# Altium project Main_board.PrjPcb
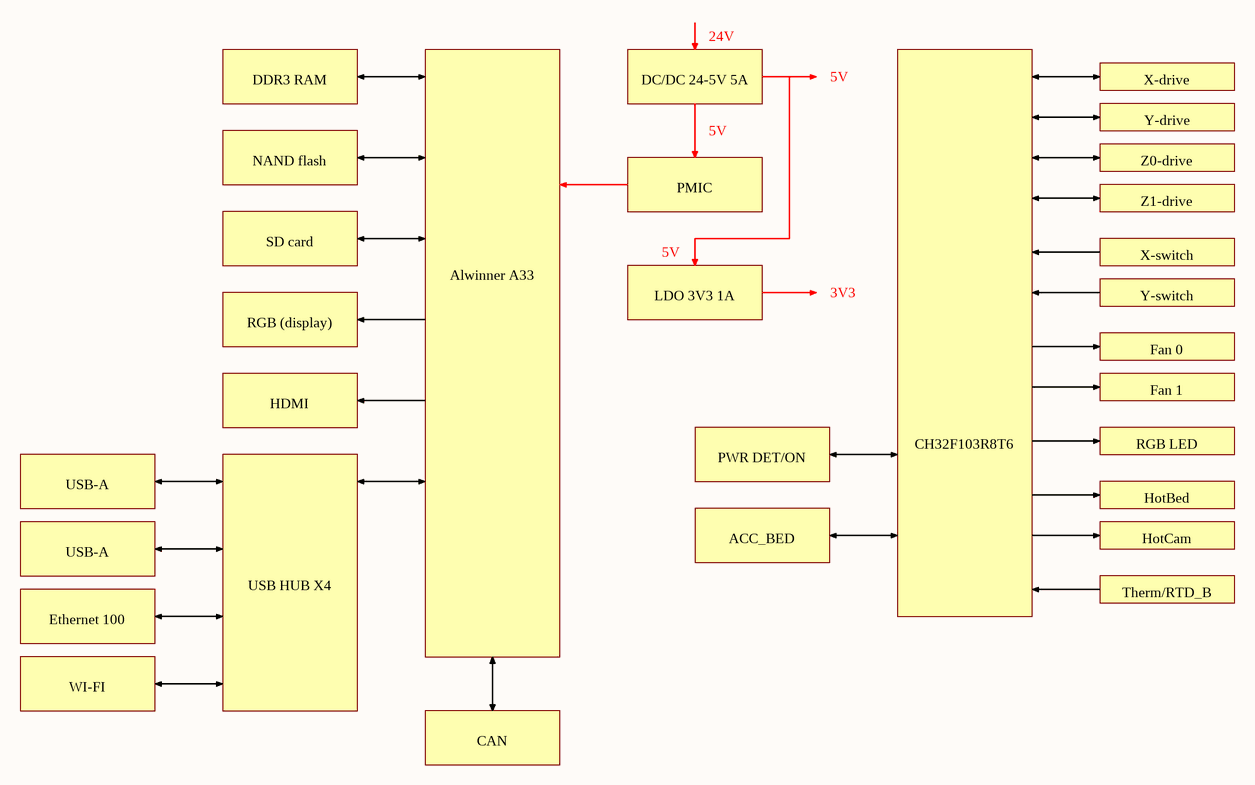
[diagram p0: Function Block Diagram.SchDoc]
5 sheets, 12 parts. Net scope: flat (ports and power ports of the same name join across sheets).
Board file: Main_board.PcbDoc
Sheets:
  Function Block Diagram.SchDoc
  NAND flash.SchDoc
  Wi-Fi AP6212.SchDoc
  PMIC AXP223.SchDoc
  CAN bus XL2515.SchDoc

## Sheet Function Block Diagram.SchDoc
size A4; SheetNumber: 1; SheetTotal: 2

### Notes on the sheet
- 24V
- DDR3 RAM
- DC/DC 24-5V 5A
- 5V
- X-drive
- Y-drive
- Z0-drive
- NAND flash
- PMIC
- Z1-drive
- SD card
- 3V3
- X-switch
- Y-switch
- RGB (display)
- LDO 3V3 1A
- Fan 0
- HDMI
- Fan 1
- USB-A
- PWR DET/ON
- RGB LED
- HotBed
- ACC_BED
- HotCam
- Ethernet 100
- CH32F103R8T6
- Therm/RTD_B
- WI-FI
- USB HUB X4
- Alwinner A33
- CAN

## Sheet NAND flash.SchDoc
size A4; SheetNumber: 5; SheetTotal: 12
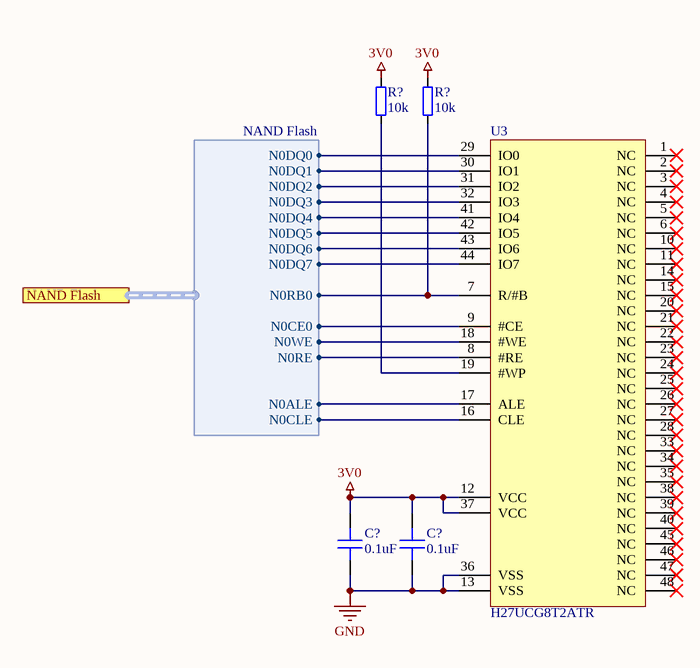
[diagram p1: NAND flash.SchDoc]

### Parts
(Parts that share a designator on the sheet are numbered #1, #2 ... from top to bottom, then left to right.)
C?#1  0.1uF  [CAPC1005X06N]
C?#2  0.1uF  [CAPC1005X06N]
R?#1  10k  [RESC1005X35N]
R?#2  10k  [RESC1005X35N]
U3  H27UCG8T2ATR  [TSSOP50P2000X120-48N]

### Ports
NAND Flash (harness NAND Flash)

### Harnesses
NAND Flash: N0DQ0, N0DQ1, N0DQ2, N0DQ3, N0DQ4, N0DQ5, N0DQ6, N0DQ7, N0RB0, N0CE0, N0WE, N0RE, N0ALE, N0CLE

### Nets
3V0: C?#1.1 C?#2.1 R?#1.1 R?#2.2 U3.12(VCC) U3.37(VCC)
GND: C?#1.2 C?#2.2 U3.13(VSS) U3.36(VSS)
NetR?#1_2: R?#1.2 U3.19(#WP)
NetR?#2_1: R?#2.1 U3.7(R/#B) ; port NAND Flash.N0RB0
NetU3_8: U3.8(#RE) ; port NAND Flash.N0RE
NetU3_9: U3.9(#CE) ; port NAND Flash.N0CE0
NetU3_16: U3.16(CLE) ; port NAND Flash.N0CLE
NetU3_17: U3.17(ALE) ; port NAND Flash.N0ALE
NetU3_18: U3.18(#WE) ; port NAND Flash.N0WE
NetU3_29: U3.29(IO0) ; port NAND Flash.N0DQ0
NetU3_30: U3.30(IO1) ; port NAND Flash.N0DQ1
NetU3_31: U3.31(IO2) ; port NAND Flash.N0DQ2
NetU3_32: U3.32(IO3) ; port NAND Flash.N0DQ3
NetU3_41: U3.41(IO4) ; port NAND Flash.N0DQ4
NetU3_42: U3.42(IO5) ; port NAND Flash.N0DQ5
NetU3_43: U3.43(IO6) ; port NAND Flash.N0DQ6
NetU3_44: U3.44(IO7) ; port NAND Flash.N0DQ7

Not connected (* = marked no-connect by the designer): U3 1(NC)* 2(NC)* 3(NC)* 4(NC)* 5(NC)* 6(NC)* 10(NC)* 11(NC)* 14(NC)* 15(NC)* 20(NC)* 21(NC)* 22(NC)* 23(NC)* 24(NC)* 25(NC)* 26(NC)* 27(NC)* 28(NC)* 33(NC)* 34(NC)* 35(NC)* 38(NC)* 39(NC)* 40(NC)* 45(NC)* 46(NC)* 47(NC)* 48(NC)*

### Library data of the parts
C?#1 C?#2 = 0402B104K500CT: Manufacturer: Walsin Tech Corp; Voltage: 50V; Tolerance: 10%; Dielectric: X7R; Min Temperature: -55; Max Temperature: 125; Part Number: 0402B104K500CT; ComponentLink1URL: https://datasheet.lcsc.com/lcsc/1810191621_Walsin-Tech-Corp-0402B104K500CT_C152814.pdf; ComponentLink1Description: Datasheet; Package: 0402; Part Status: Active; Capacitance: 0.1uF
R?#1 R?#2 = WR04X1002FTL: Resistor; Manufacturer: Walsin Tech Corp; Tolerance: 1%; Power: 1/16 W; Temperature Coefficient: 100ppm; Min Temperature: -55°C; Max Temperature: 155°C; Part Number: WR04X1002FTL; ComponentLink1URL: https://datasheet.lcsc.com/lcsc/2304140030_Walsin-Tech-Corp-WR04X1002FTL_C163810.pdf; ComponentLink1Description: Datasheet; Package: 0402; Part Status: Active; Resistance: 10k
U3 = H27UCG8T2ATR: NAND Flash Memory; MANUFACTURER: SK Hynix; Part Number: H27UCG8T2ATR; COMPONENTLINK1URL: https://z3d9b7u8.stackpathcdn.com/pdf-down/H/2/7/H27UCG8T2ATR-BC-Hynix.pdf; COMPONENTLINK1DESCRIPTION: Datasheet; PACKAGE: TSSOP-48; Part Status: Active

## Sheet Wi-Fi AP6212.SchDoc
size A4; SheetNumber: 6; SheetTotal: 12
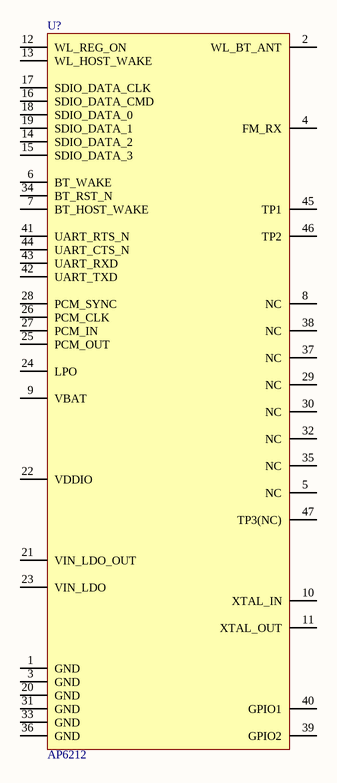
[diagram p2: Wi-Fi AP6212.SchDoc]

### Parts
(Parts that share a designator on the sheet are numbered #1, #2 ... from top to bottom, then left to right.)
U?#1  AP6212  [QFN-44_L12.0-W12.0-P0.90-TL_AP6212]

### Nets

Not connected (* = marked no-connect by the designer): U?#1 1(GND) 2(WL_BT_ANT) 3(GND) 4(FM_RX) 5(NC) 6(BT_WAKE) 7(BT_HOST_WAKE) 8(NC) 9(VBAT) 10(XTAL_IN) 11(XTAL_OUT) 12(WL_REG_ON) 13(WL_HOST_WAKE) 14(SDIO_DATA_2) 15(SDIO_DATA_3) 16(SDIO_DATA_CMD) 17(SDIO_DATA_CLK) 18(SDIO_DATA_0) 19(SDIO_DATA_1) 20(GND) 21(VIN_LDO_OUT) 22(VDDIO) 23(VIN_LDO) 24(LPO) 25(PCM_OUT) 26(PCM_CLK) 27(PCM_IN) 28(PCM_SYNC) 29(NC) 30(NC) 31(GND) 32(NC) 33(GND) 34(BT_RST_N) 35(NC) 36(GND) 37(NC) 38(NC) 39(GPIO2) 40(GPIO1) 41(UART_RTS_N) 42(UART_TXD) 43(UART_RXD) 44(UART_CTS_N) 45(TP1) 46(TP2) 47(TP3(NC))

### Library data of the parts
U?#1 = AP6212: WiFi+Bluetooth 4.0+FM RX Module; MANUFACTURER: AMPAK Tech; Part Number: AP6212; COMPONENTLINK1URL: https://datasheet.lcsc.com/lcsc/2111121030_AMPAK-Tech-AP6212_C2798300.pdf; COMPONENTLINK1DESCRIPTION: Datasheet; PACKAGE: ESP-12F; Part Status: Active

## Sheet PMIC AXP223.SchDoc
size A3; SheetNumber: 7; SheetTotal: 12
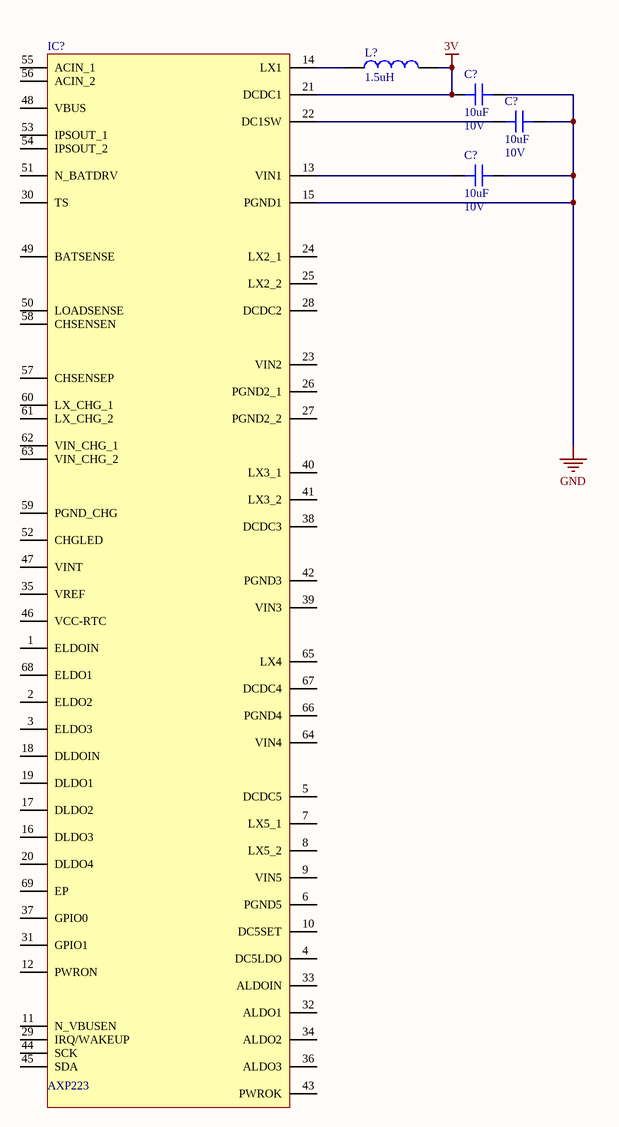
[diagram p3: PMIC AXP223.SchDoc]

### Parts
(Parts that share a designator on the sheet are numbered #1, #2 ... from top to bottom, then left to right.)
C?#3  Voltage: 10V  [CAPC2012X14N]  (hidden comment: 10uF)
C?#4  Voltage: 10V  [CAPC2012X14N]  (hidden comment: 10uF)
C?#5  Voltage: 10V  [CAPC2012X14N]  (hidden comment: 10uF)
IC?  AXP223  [QFN40P800X800X80-69N-D]
L?  1.5uH  [INDP400L400WX180_N]

### Nets
3V: C?#3.2 IC?.21(DCDC1) L?.2
GND: C?#3.1 C?#4.1 C?#5.1 IC?.15(PGND1)
NetC?#4_2: C?#4.2 IC?.22(DC1SW)
NetC?#5_2: C?#5.2 IC?.13(VIN1)
NetIC?_14: IC?.14(LX1) L?.1

Not connected (* = marked no-connect by the designer): IC? 1(ELDOIN) 2(ELDO2) 3(ELDO3) 4(DC5LDO) 5(DCDC5) 6(PGND5) 7(LX5_1) 8(LX5_2) 9(VIN5) 10(DC5SET) 11(N_VBUSEN) 12(PWRON) 16(DLDO3) 17(DLDO2) 18(DLDOIN) 19(DLDO1) 20(DLDO4) 23(VIN2) 24(LX2_1) 25(LX2_2) 26(PGND2_1) 27(PGND2_2) 28(DCDC2) 29(IRQ/WAKEUP) 30(TS) 31(GPIO1) 32(ALDO1) 33(ALDOIN) 34(ALDO2) 35(VREF) 36(ALDO3) 37(GPIO0) 38(DCDC3) 39(VIN3) 40(LX3_1) 41(LX3_2) 42(PGND3) 43(PWROK) 44(SCK) 45(SDA) 46(VCC-RTC) 47(VINT) 48(VBUS) 49(BATSENSE) 50(LOADSENSE) 51(N_BATDRV) 52(CHGLED) 53(IPSOUT_1) 54(IPSOUT_2) 55(ACIN_1) 56(ACIN_2) 57(CHSENSEP) 58(CHSENSEN) 59(PGND_CHG) 60(LX_CHG_1) 61(LX_CHG_2) 62(VIN_CHG_1) 63(VIN_CHG_2) 64(VIN4) 65(LX4) 66(PGND4) 67(DCDC4) 68(ELDO1) 69(EP)

### Library data of the parts
C?#3-C?#5 = 0805B106K100NT: Manufacturer: FH (Guangdong Fenghua Advanced Tech); Tolerance: 10%; Dielectric: X7R; Min Temperature: -55; Max Temperature: 125; Part Number: 0805B106K100NT; ComponentLink1URL: https://datasheet.lcsc.com/lcsc/2304140030_FH--Guangdong-Fenghua-Advanced-Tech-0805B106K100NT_C90544.pdf; ComponentLink1Description: Datasheet; Package: 0805; Part Status: Active; Capacitance: 10uF
IC? = AXP223: Integrated Circuit; MANUFACTURER: X-Powers Tech; Part Number: AXP223; COMPONENTLINK1URL: https://datasheet.lcsc.com/lcsc/2204191745_X-Powers-Tech-AXP223_C2997893.pdf; COMPONENTLINK1DESCRIPTION: Datasheet; PACKAGE: QFN-68EP; Part Status: Active
L? = SWPA4018S1R5NT: MANUFACTURER: Sunlord; TOLERANCE: 30%; RESISTANCE: 0.039; SELF RESONANT FREQUENCY: 65MHz; RATED CURRENT: 1.8A; SATURATION CURRENT: 3.35A; Part Number: SWPA4018S1R5NT; COMPONENTLINK1URL: https://datasheet.lcsc.com/lcsc/2110091630_Sunlord-SWPA4018S1R5NT_C80662.pdf; COMPONENTLINK1DESCRIPTION: Datasheet; PACKAGE: 4018; Part Status: Active; INDUCTANCE: 1.5uH

## Sheet CAN bus XL2515.SchDoc
size A4; SheetNumber: 8; SheetTotal: 12
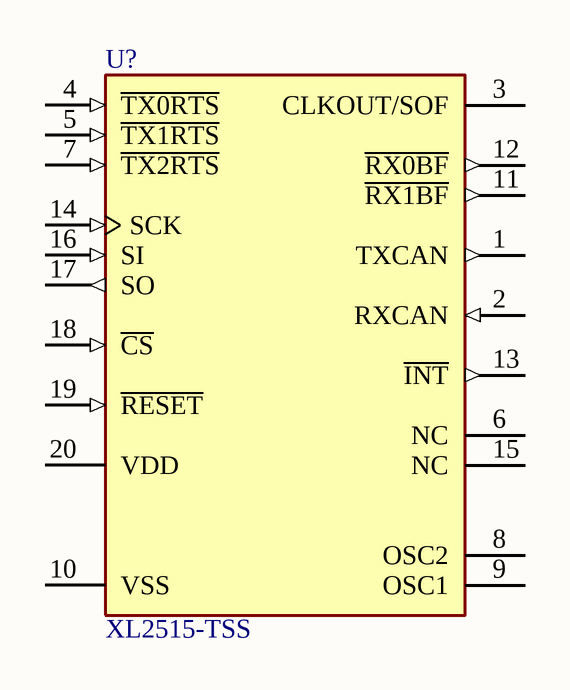
[diagram p4: CAN bus XL2515.SchDoc]

### Parts
(Parts that share a designator on the sheet are numbered #1, #2 ... from top to bottom, then left to right.)
U?#2  XL2515-TSS  [TSOP65P640X110-20N]

### Nets

Not connected (* = marked no-connect by the designer): U?#2 1(TXCAN) 2(RXCAN) 3(CLKOUT/SOF) 4(~{TX0RTS}) 5(~{TX1RTS}) 6(NC) 7(~{TX2RTS}) 8(OSC2) 9(OSC1) 10(VSS) 11(~{RX1BF}) 12(~{RX0BF}) 13(~{INT}) 14(SCK) 15(NC) 16(SI) 17(SO) 18(~{CS}) 19(~{RESET}) 20(VDD)

### Library data of the parts
U?#2 = XL2515-TSS: IC CAN CTLR W/SPI 2.0B 20-QFN; Manufacturer: XINLUDA; Part Number: XL2515-TSS; ComponentLink1URL: https://datasheet.lcsc.com/lcsc/2012081507_XINLUDA-XL2515-TSS_C609745.pdf; ComponentLink1Description: Datasheet; Package: TSSOP-20; Part Status: Active

## Nets that join several sheets
GND: NAND flash (C?#1.2 C?#2.2 U3.13 U3.36), PMIC AXP223 (C?#3.1 C?#4.1 C?#5.1 IC?.15)

## Assembly variants
Assembly: not fitted R? R? R?